# Altium schematic sheet Sheet1.SchDoc
size A4
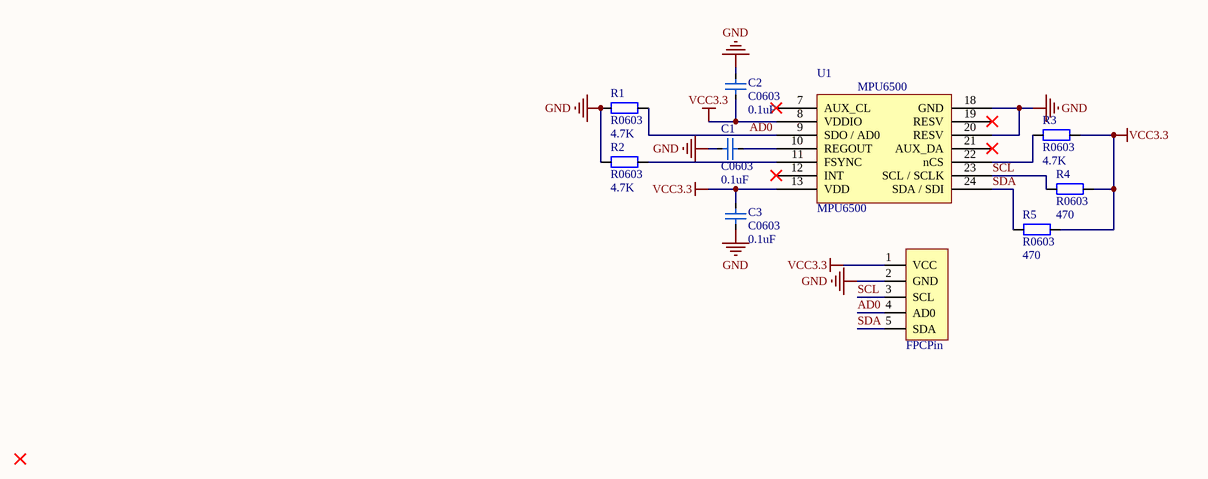
[diagram p0: Sheet1.SchDoc]

## Parts
*  FPCPin  [FPCPin_5]
C1  C0603  value 0.1uF  [CAPC1608X09N]
C2  C0603  value 0.1uF  [CAPC1608X09N]
C3  C0603  value 0.1uF  [CAPC1608X09N]
R1  R0603  value 4.7K  [RESC1608X09N]
R2  R0603  value 4.7K  [RESC1608X09N]
R3  R0603  value 4.7K  [RESC1608X09N]
R4  R0603  value 470  [RESC1608X09N]
R5  R0603  value 470  [RESC1608X09N]
U1  MPU6500  [QFN40P300X300X90_HS-25N]

## Nets
GND: *.2(GND) C1.1 C2.1 C3.2 R1.2 R2.2 U1.18(GND) U1.20(RESV)
VCC3.3: *.1(VCC) C2.2 C3.1 R3.1 R4.1 R5.1 U1.8(VDDIO) U1.13(VDD)
AD0: *.4(AD0) R1.1 U1.9(SDO_/_AD0)
SCL: *.3(SCL) R4.2 U1.23(SCL_/_SCLK)
SDA: *.5(SDA) R5.2 U1.24(SDA_/_SDI)
NetC1_2: C1.2 U1.10(REGOUT)
NetR2_1: R2.1 U1.11(FSYNC)
NetR3_2: R3.2 U1.22(nCS)

Not connected (* = marked no-connect by the designer): U1 7(AUX_CL)* 12(INT)* 19(RESV)* 21(AUX_DA)*

## Library data of the parts
U1 = Component_1